# Altium schematic sheet 时钟电路.SchDoc
size A4
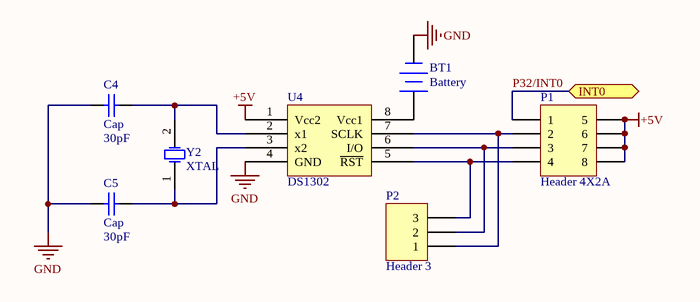
[diagram p0: 时钟电路.SchDoc]

## Parts
BT1  Battery  [BAT-2]
C4  Cap  value 30pF  [RAD-0.3]
C5  Cap  value 30pF  [RAD-0.3]
P1  Header 4X2A  [HDR2X4_CEN]
P2  Header 3  [HDR1X3]
U4  DS1302  [SOIC127P1030-8L]
Y2  XTAL  [R38]

## Ports
INT0 (bidir)

## Nets
+5V: P1.5 P1.6 P1.7 P1.8 U4.1(Vcc2)
GND: BT1.2(-) C4.2 C5.1 U4.4(GND)
P32/INT0: P1.1 ; port INT0
NetBT1_1: BT1.1(+) U4.8(Vcc1)
NetC4_1: C4.1 U4.2(x1) Y2.2(OSC2)
NetC5_2: C5.2 U4.3(x2) Y2.1(OSC1)
NetP1_2: P1.2 P2.1 U4.7(SCLK)
NetP1_3: P1.3 P2.2 U4.6(I/O)
NetP1_4: P1.4 P2.3 U4.5(~{RST})

## Notes on the sheet
- 专升本
- 通信工程
- 李烨攀
- 2101班
- 210806300163
- 学号

## Library data of the parts
BT1 = Battery: Multicell Battery; Published: 24-Mar-1999; LatestRevisionDate: 17-Jul-2002; LatestRevisionNote: Re-released for DXP Platform.; PackageReference: BAT-2; Publisher: Altium Limited; PackageDescription: Battery; 2 Leads
C4 C5 = Cap: Capacitor; Published: 8-Jun-2000; LatestRevisionDate: 17-Jul-2002; LatestRevisionNote: Re-released for DXP Platform.; PackageReference: RAD-0.3; Publisher: Altium Limited; PackageDescription: Radial Cap, Thru-Hole; 2 Leads; 0.3 in Pin Spacing
P1 = Header 4X2A: Header, 4-Pin, Dual row; LatestRevisionDate: 17-Jul-2002; LatestRevisionNote: Re-released for DXP Platform.; Publisher: Altium Limited
P2 = Header 3: Header, 3-Pin; LatestRevisionDate: 17-Jul-2002; LatestRevisionNote: Re-released for DXP Platform.; Publisher: Altium Limited
Y2 = XTAL: Crystal Oscillator; Published: 8-Jun-2000; LatestRevisionDate: 17-Jul-2002; LatestRevisionNote: Re-released for DXP Platform.; PackageReference: R38; Publisher: Altium Limited; PackageDescription: Crystal, Thru-Hole; 2 Leads; Body 3.1 x 8.2 mm (Dia.xH)